# Altium schematic sheet BSPD - AMS.SchDoc
size A4
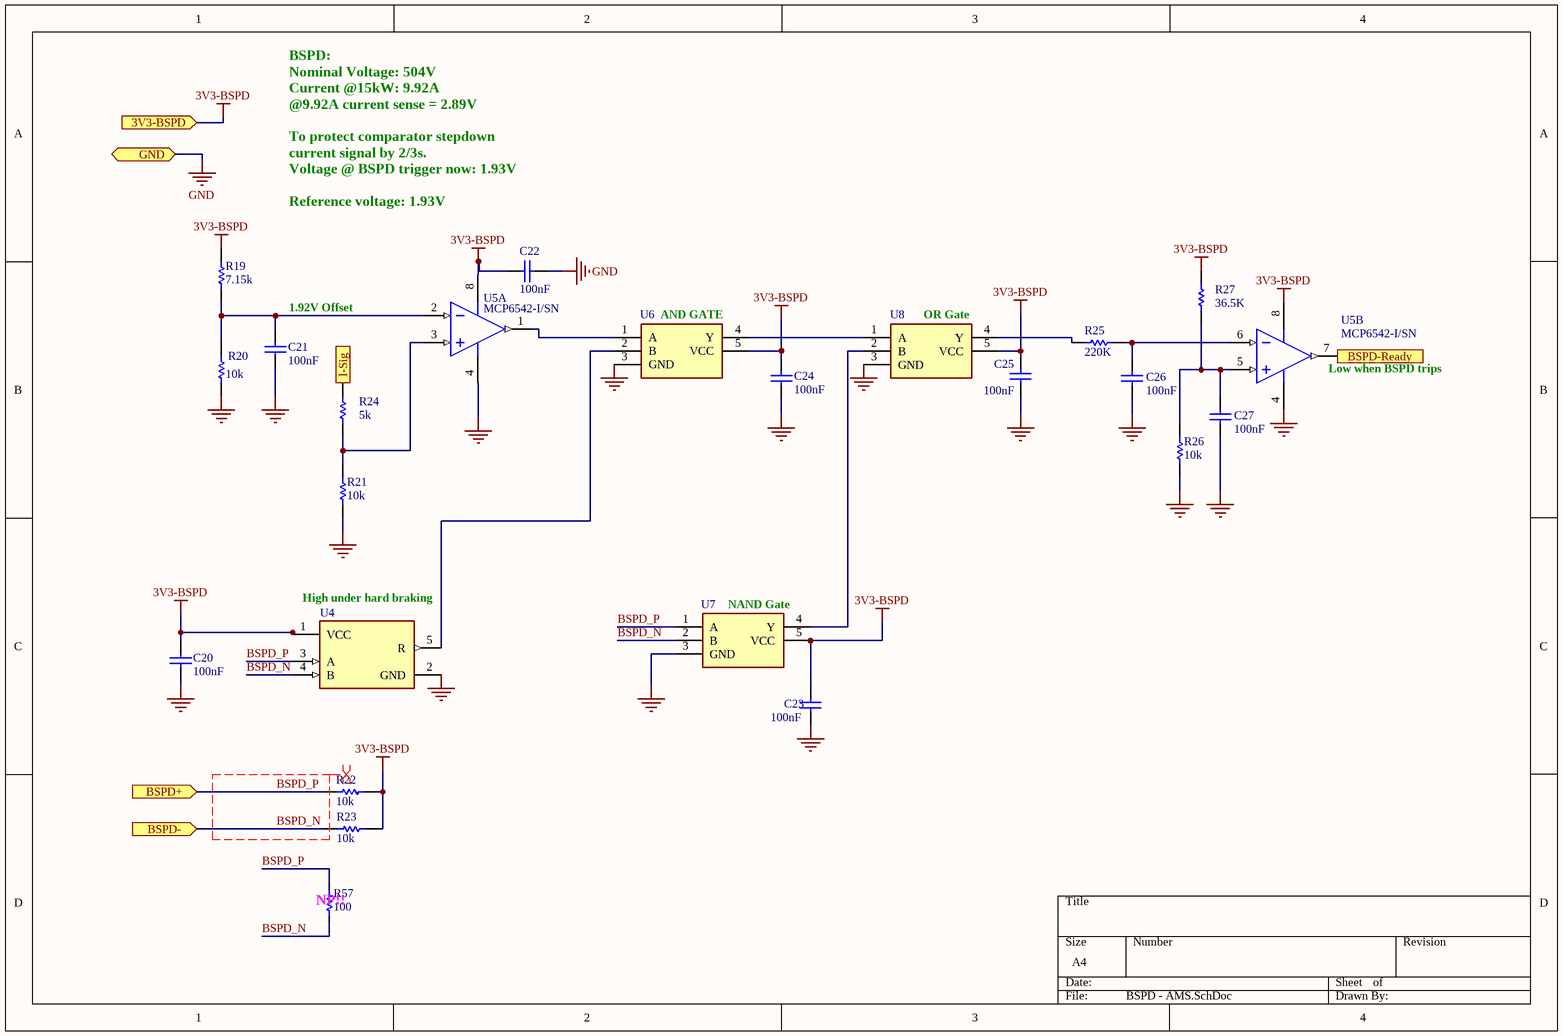
[diagram p0: BSPD - AMS.SchDoc]

## Parts
C20  value 100nF  [CAP0603]  (hidden comment: C0603C104K3RAC7013)
C21  value 100nF  [CAP0603]  (hidden comment: C0603C104K3RAC7013)
C22  value 100nF  [CAP0603]  (hidden comment: C0603C104K3RAC7013)
C23  value 100nF  [CAP0603]  (hidden comment: C0603C104K3RAC7013)
C24  value 100nF  [CAP0603]  (hidden comment: C0603C104K3RAC7013)
C25  value 100nF  [CAP0603]  (hidden comment: C0603C104K3RAC7013)
C26  value 100nF  [CAP0603]  (hidden comment: C0603C104K3RAC7013)
C27  value 100nF  [CAP0603]  (hidden comment: C0603C104K3RAC7013)
R19  value 7.15k  [RESC1608X55N]  (hidden comment: RN73C1J7K15BTDF)
R20  value 10k  [RESC1608X55N]  (hidden comment: RC0603FR-1310KL)
R21  value 10k  [RESC1608X55N]  (hidden comment: RC0603FR-1310KL)
R22  value 10k  [RESC1608X55N]  (hidden comment: RC0603FR-1310KL)
R23  value 10k  [RESC1608X55N]  (hidden comment: RC0603FR-1310KL)
R24  value 5k  [RESC1608X55N]  (hidden comment: CR0603AFX-5101EAS)
R25  value 220K  [RESC1608X55N]  (hidden comment: CRCW0603-220K-E3)
R26  value 10k  [RESC1608X55N]  (hidden comment: RC0603FR-1310KL)
R27  value 36.5K  [RESC1608X55N]  (hidden comment: CRCW060336K5FKEAC)
R57  value 100  [R-0603]  (hidden comment: Resistor)
U4  SN65LVDT2DBVT  [FP-DBV0005A-MFG]  (value not drawn)
U5  MCP6542-I/SN  [SOIC-SN8_N]  (parts A,B of 2)
U6  SN74LVC1G08MDBVREP  [SOT95P280X145-5N]  (value not drawn)
U7  NC7SZ00M5X  [SOT95P280X125-5N]  (value not drawn)
U8  NC7S32M5X  [SOT95P275X110-5N]  (value not drawn)

## Ports
3V3-BSPD (in), BSPD+ (in), BSPD- (in), BSPD-Ready (out), GND (bidir), I-Sig (in)

## Nets
3V3-BSPD: C20.2 C22.2 C23.2 C24.2 C25.2 R19.2 R22.2 R23.2 R27.2 U4.1(VCC) U5.8(VDD) U6.5(VCC) U7.5(VCC) U8.5(VCC) ; port 3V3-BSPD
GND: C20.1 C21.1 C22.1 C23.1 C24.1 C25.1 C26.1 C27.1 R20.1 R21.1 R26.1 U4.2(GND) U5.4(VSS) U6.3(GND) U7.3(GND) U8.3(GND) ; port GND
BSPD-Ready: U5.7(OUTB) ; port BSPD-Ready
BSPD_N: R23.1 R57.1 U4.4(B) U7.2(B) ; port BSPD-
BSPD_P: R22.1 R57.2 U4.3(A) U7.1(A) ; port BSPD+
I-Sig: R24.2 ; port I-Sig
NetC21_2: C21.2 R19.1 R20.2 U5.2(VINA-)
NetC26_2: C26.2 R25.1 U5.6(VINB-)
NetC27_2: C27.2 R26.2 R27.1 U5.5(VINB+)
NetR21_2: R21.2 R24.1 U5.3(VINA+)
NetR25_2: R25.2 U8.4(Y)
NetU4_5: U4.5(R) U6.2(B)
NetU5_1: U5.1(OUTA) U6.1(A)
NetU6_4: U6.4(Y) U8.1(A)
NetU7_4: U7.4(Y) U8.2(B)

## Layout directives
differential pair; differential pair class BSPD: BSPD_N, BSPD_P

## Notes on the sheet
- BSPD:
  Nominal Voltage: 504V
  Current @15kW: 9.92A
  @9.92A current sense = 2.89V
  To protect comparator stepdown current signal by 2/3s.
  Voltage @ BSPD trigger now: 1.93V
  Reference voltage: 1.93V
- (near C21) 1.92V Offset
- (near U6) AND GATE
- (near U8) OR Gate
- (near U5) Low when BSPD trips
- (near U4) High under hard braking
- (near U7) NAND Gate
- (near R57) NP!!

## Library data of the parts
C20-C27 = Cap: Published: 8-Jun-2000; LatestRevisionDate: 17-Jul-2002; LatestRevisionNote: Re-released for DXP Platform.; PackageReference: RAD-0.3; Publisher: Altium Limited; PackageDescription: Radial Cap, Thru-Hole; 2 Leads; 0.3 in Pin Spacing
R19-R21 R24 = Res1: Published: 8-Jun-2000; LatestRevisionDate: 17-Jul-2002; LatestRevisionNote: Re-released for DXP Platform.; PackageReference: AXIAL-0.3; Publisher: Altium Limited; PackageDescription: Axial Device, Thru-Hole; 2 Leads; 0.3 in Pin Spacing
R22 R23 = Res1: 169-4216; Published: 8-Jun-2000; LatestRevisionDate: 17-Jul-2002; LatestRevisionNote: Re-released for DXP Platform.; PackageReference: AXIAL-0.3; Publisher: Altium Limited; PackageDescription: Axial Device, Thru-Hole; 2 Leads; 0.3 in Pin Spacing
R25-R27 = Res1: Resistor; Published: 8-Jun-2000; LatestRevisionDate: 17-Jul-2002; LatestRevisionNote: Re-released for DXP Platform.; PackageReference: AXIAL-0.3; Publisher: Altium Limited; PackageDescription: Axial Device, Thru-Hole; 2 Leads; 0.3 in Pin Spacing
R57 = Resistor: NP
U4 = CMP-04872-000003-1: IC RECEIVER 0/1 SOT23-5; Manufacturer: Texas Instruments; Max Supply Voltage: 3.6V; Standoff Height: 0mm; Nominal Supply Current: 2-5.5mA; Interface: LVDS,LVTTL; Min Supply Voltage: 2.4V; Device Class L3: unset; Category: IC; Automotive: No; Ambient Temperature Range High: +85°C; Ambient Temperature Range Low: -40°C; Temperature Range Low: -40°C; RoHS: TRUE; ComponentLink2Description: Datasheet; Package: DBV0005A; Device Class L1: Integrated Circuits (ICs); Mouser Description: LVDS Interface IC Dual LVDS; Digikey Description: IC RECEIVER 0/1 SOT23-5; ComponentLink2URL: http://www.ti.com/lit/ds/symlink/sn65lvdt2.pdf; Height: 1.45mm; Temperature: -40°C to +85°C; Temperature Range High: +85°C; Lead Free: Yes; Octopart: https://octopart.com/sn65lvdt2dbvt-texas+instruments-712102; Device Class L2: Interface ICs; Manufacturer Part Number: SN65LVDT2DBVT
U5 = CMP-0187-00180-2: Push-Pull Output Sub-Microamp Comparator, 8-Pin SOIC, Industrial Temperature; PackageReference: SOIC-SN8; PackageVersion: revBB, Aug-2009; ComponentLink3URL: http://www.microchip.com/stellent/groups/techpub_sg/documents/packagingspec/en012702.pdf; Code_JEDEC: MS-012; DatasheetVersion: revH, Dec-2011; ComponentLink1URL: http://www.microchip.com/; ComponentLink2Description: Datasheet; RevisionNote: URLs added. DatasheetVersion updated.; ComponentLink2URL: http://ww1.microchip.com/downloads/en/DeviceDoc/21696H.pdf; ComponentLink3Description: Package Specification; ComponentLink1Description: Manufacturer URL; Code_IPC: SOIC127P600-8; PackageDescription: 8-Lead Plastic Small Outline (SN) - Narrow, 3.90mm Body [SOIC]
U6 = SN74LVC1G08MDBVREP: Integrated Circuit; Manufacturer_Name: Texas Instruments; Datasheet Link: http://www.ti.com/lit/gpn/sn74lvc1g08-ep; Height: 1.45mm; Mouser2 Part Number: 595-SN74LVC08MDBVREP; Mouser2 Price/Stock: https://www.mouser.com/Search/Refine.aspx?Keyword=595-SN74LVC08MDBVREP; Manufacturer_Part_Number: SN74LVC1G08MDBVREP
U7 = NC7S02M5X: NAND GATEEE; Manufacturer_Name: ON Semiconductor; Height: 1.25mm; Manufacturer_Part_Number: NC7S02M5X
U8 = NC7S32M5X: OR GATEEEE; Manufacturer_Name: ON Semiconductor; Datasheet Link: https://componentsearchengine.com/Datasheets/2/NC7S32M5X.pdf; Height: 1.1mm; Manufacturer_Part_Number: NC7S32M5X